# Altium project Robot-Mainboard V3.0.PrjPcb
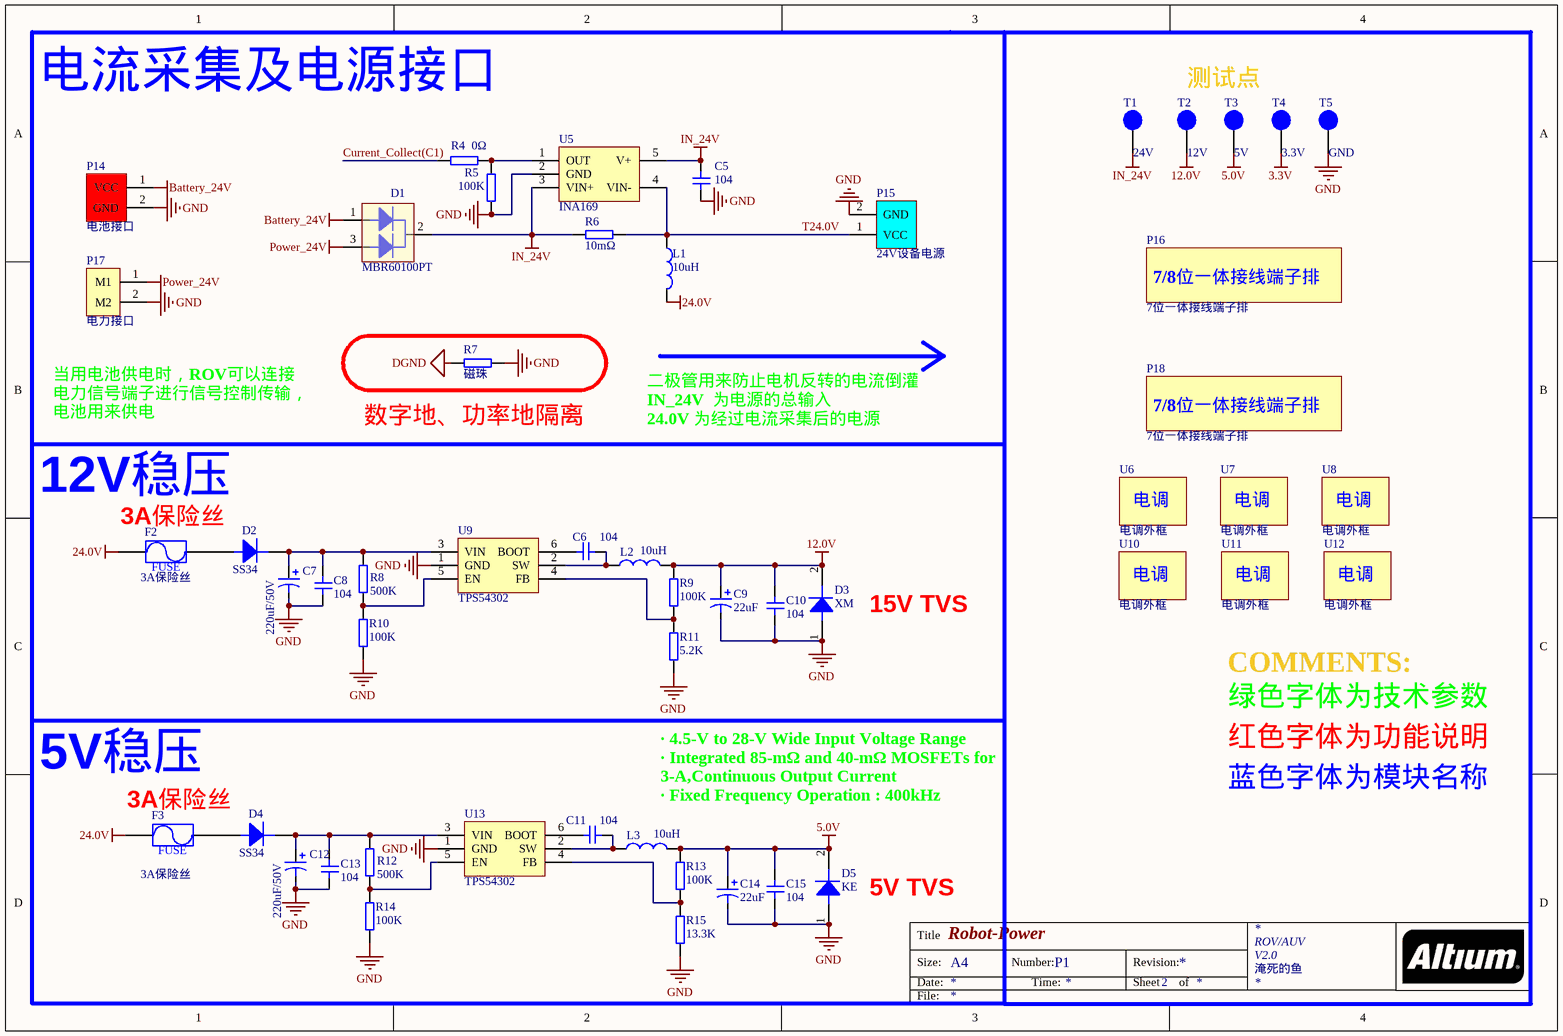
[diagram p0: Robot-Power V3.0.SchDoc]
2 sheets, 79 parts. Net scope: global (net labels, ports and power ports of the same name join across sheets).
Board file: ROV_MainBoard V3.0.PcbDoc
Sheets:
  Robot-Power V3.0.SchDoc
  Robot-Control V3.0.SchDoc

## Sheet Robot-Power V3.0.SchDoc: Robot-Power
size A4; Date: 2019.6.25; Engineer: 淹死的鱼; Address1: ROV/AUV; Address2: V2.0; Address3: 淹死的鱼; DocumentNumber: P1; SheetNumber: 2

### Parts
C5  104  [0805C]
C6  104  [0805C]
C7  220uF/50V  [RB.1.2]
C8  104  [0805C]
C9  22uF  [TAJ-C]
C10  104  [0805C]
C11  104  [0805C]
C12  220uF/50V  [RB.1.2]
C13  104  [0805C]
C14  22uF  [TAJ-C]
C15  104  [0805C]
D1  MBR60100PT  [TO-247LS]
D2  SS34  [SMA/DO-214AC]
D3  XM  [SMBJ]
D4  SS34  [SMA/DO-214AC]
D5  KE  [SMBJ]
F2  3A保险丝  [FUSE-1206]
F3  3A保险丝  [FUSE-1206]
L1  10uH  [CDRH124]
L2  10uH  [CDRH124]
L3  10uH  [CDRH124]
P14  电池接口  [XT60-F]
P15  24V设备电源  [XT60-F]
P16  7位一体接线端子排  [7/8一体接线端子]
P17  电力接口  [XT60-F]
P18  7位一体接线端子排  [7/8一体接线端子]
R4  0Ω  [0805R]
R5  100K  [0805R]
R6  10mΩ  [2512R]
R7  磁珠  [1210R]
R8  500K  [0805R]
R9  100K  [0805R]
R10  100K  [0805R]
R11  5.2K  [0805R]
R12  500K  [0805R]
R13  100K  [0805R]
R14  100K  [0805R]
R15  13.3K  [0805R]
T1  24V  [HEADER 1]
T2  12V  [HEADER 1]
T3  5V  [HEADER 1]
T4  3.3V  [HEADER 1]
T5  GND  [HEADER 1]
U5  INA169  [SOT23-5]
U6  电调外框  [电调外框]
U7  电调外框  [电调外框]
U8  电调外框  [电调外框]
U9  TPS54302  [SOT23-6]
U10  电调外框  [电调外框]
U11  电调外框  [电调外框]
U12  电调外框  [电调外框]
U13  TPS54302  [SOT23-6]

### Nets
3.3V: T4.1
5.0V: C14.1 C15.2 D5.2 L3.2 R13.2 T3.1
12.0V: C9.1 C10.2 D3.2 L2.2 R9.2 T2.1
24.0V: F2.1 F3.1 L1.2
Battery_24V: D1.1 P14.1(VCC)
DGND: R7.2
GND: C5.1 C7.2 C8.1 C9.2 C10.1 C12.2 C13.1 C14.2 C15.1 D3.1 D5.1 P14.2(GND) P15.2(GND) P17.2(M2) R5.2 R7.1 R10.1 R11.1 R14.1 R15.1 T5.1 U5.2(GND) U9.1(GND) U13.1(GND)
IN_24V: C5.2 D1.2 R6.2 T1.1 U5.3(VIN+) U5.5(V+)
Power_24V: D1.3 P17.1(M1)
Current_Collect(C1): R4.1
T24.0V: L1.1 P15.1(VCC) R6.1 U5.4(VIN-)
NetC6_1: C6.1 L2.1 U9.2(SW)
NetC6_2: C6.2 U9.6(BOOT)
NetC7_1: C7.1 C8.2 D2.2 R8.2 U9.3(VIN)
NetC11_1: C11.1 L3.1 U13.2(SW)
NetC11_2: C11.2 U13.6(BOOT)
NetC12_1: C12.1 C13.2 D4.2 R12.2 U13.3(VIN)
NetD2_1: D2.1 F2.2
NetD4_1: D4.1 F3.2
NetR4_2: R4.2 R5.1 U5.1(OUT)
NetR8_1: R8.1 R10.2 U9.5(EN)
NetR9_1: R9.1 R11.2 U9.4(FB)
NetR12_1: R12.1 R14.2 U13.5(EN)
NetR13_1: R13.1 R15.2 U13.4(FB)

### Notes on the sheet
- 电流采集及电源接口
- 测试点
- (near R7) 数字地、功率地隔离
- 二极管用来防止电机反转的电流倒灌
  IN_24V  为电源的总输入
  24.0V 为经过电流采集后的电源
- (near F2) 12V稳压
- 当用电池供电时，ROV可以连接
  电力信号端子进行信号控制传输，
  电池用来供电
- (near F2) 3A保险丝
- (near D3) 15V TVS
- 绿色字体为技术参数
- COMMENTS:
- 5V稳压
- 红色字体为功能说明
- 蓝色字体为模块名称
- (near F3) 3A保险丝
- · 4.5-V to 28-V Wide Input Voltage Range
  · Integrated 85-mΩ and 40-mΩ MOSFETs for 3-A,Continuous Output Current
  · Fixed Frequency Operation : 400kHz
- (near D5) 5V TVS
- Title
- Size:
- Date:
- A4
- Number:
- Time:
- Revision:
- Sheet
- of
- File:
- (in symbol 7位一体接线端子排) 7/8位一体接线端子排
- (in symbol Fuse) FUSE

### Library data of the parts
C5 C6 C8 C10 C11 C13 C15 = Cap1: 无极贴片电容
C7 C12 = Cap3: 直插极性电容
C9 C14 = Pol Cap: 极性贴片电容
D2-D5 = Diode: 二极管
F2 F3 = Fuse: 保险丝
L1-L3 = L: 电感
P14 = 电源端子
P15 = 推进器电源
P17 = 接线端子-2PIN: 2PIN
R4-R15 = Res: 电阻
T1-T5 = 测试点
U6-U8 U10-U12 = 电调

## Sheet Robot-Control V3.0.SchDoc: ROV-Control
size A4; Date: 2019.6.25; ApprovedBy: 10; CompanyName: 9; Engineer: 淹死的鱼; Organization: 5; Address1: ROV/AUV; Address2: V1.0; Address3: 淹死的鱼; Address4: 12; DocumentNumber: P1; Revision: 3; SheetNumber: 2; SheetTotal: 1; Time: 2019.4.6; DocumentFullPathAndName: 8; DocumentName: 7; ModifiedDate: 6; ImagePath: C:\Users\zengwangfa\Pictures\Saved Pictures\电协logo重绘（10000像素版）.png; ProjectName: 4; Application_BuildNumber: 11
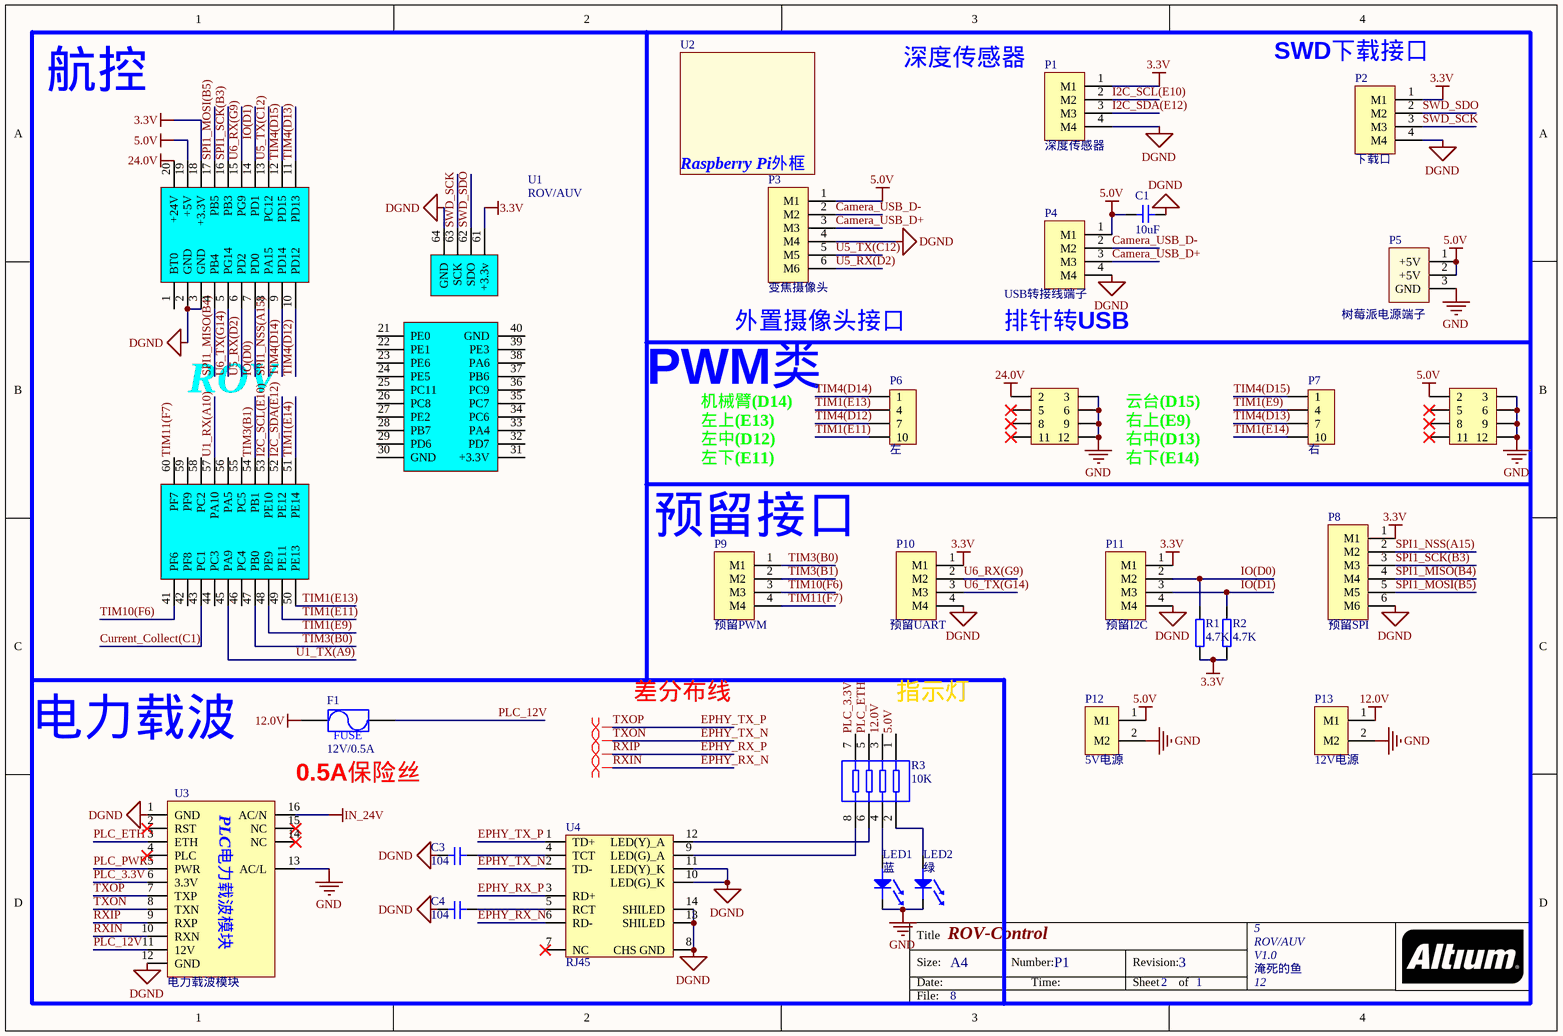
[diagram p1: Robot-Control V3.0.SchDoc]

### Parts
?  (no value)  [JMU_LOGO(1.35cm)]
C1  10uF  [0805C]
C3  104  [0805C]
C4  104  [0805C]
F1  12V/0.5A  [FUSE-1206]
LED1  蓝  [0805LED(RED)]
LED2  绿  [0805LED(RED)]
P1  深度传感器  [MX1.25WS-4P]
P2  下载口  [MX1.25WS-4P]
P3  变焦摄像头  [MX1.25WS-6P]
P4  USB转接线端子  [MX1.25WS-4P]
P5  树莓派电源端子  [XH3/2.54mm/180]
P6  左  [Header 4X3]
P7  右  [Header 4X3]
P8  预留SPI  [MX1.25WS-6P]
P9  预留PWM  [MX1.25WS-4P]
P10  预留UART  [MX1.25WS-4P]
P11  预留I2C  [MX1.25WS-4P]
P12  5V电源  [KF128-2P]
P13  12V电源  [KF128-2P]
R1  4.7K  [0805R]
R2  4.7K  [0805R]
R3  10K  [排阻(4位贴片)]
U1  ROV/AUV  [ROV_CONTROLLER]
U2  (no value)  [Raspberry Pi 外框]
U3  电力载波模块  [电力载波模块6410]
U4  RJ45  [RJ45]

### Nets
3.3V: P1.1(M1) P2.1(M1) P8.1(M1) P10.1(M1) P11.1(M1) R1.1 R2.1 U1.18(+3.3V) U1.61(+3.3v)
5.0V: C1.2 P3.1(M1) P4.1(M1) P5.1(+5V) P5.2(+5V) P7.2 P12.1(M1) R3.1 U1.19(+5V)
12.0V: F1.1 P13.1(M1) R3.3
24.0V: P6.2 U1.20(+24V)
DGND: C1.1 C3.1 C4.1 P1.4(M4) P2.4(M4) P3.4(M4) P4.4(M4) P8.6(M6) P10.4(M4) P11.4(M4) U1.2(GND) U1.3(GND) U1.64(GND) U3.1(GND) U3.12(GND) U4.8(CHS_GND) U4.10(LED(G)_K) U4.11(LED(Y)_K) U4.13(SHILED) U4.14(SHILED)
GND: LED1.2 LED2.2 P5.3(GND) P6.3 P6.6 P6.9 P6.12 P7.3 P7.6 P7.9 P7.12 P12.2(M2) P13.2(M2) U3.13(AC/L)
IN_24V: U3.16(AC/N)
Camera_USB_D+: P3.3(M3) P4.3(M3)
Camera_USB_D-: P3.2(M2) P4.2(M2)
Current_Collect(C1): U1.43(PC1)
EPHY_RX_N: U3.10(RXN) U4.6(RD-)  [also labelled RXIN]
EPHY_RX_P: U3.9(RXP) U4.3(RD+)  [also labelled RXIP]
EPHY_TX_N: U3.8(TXN) U4.2(TD-)  [also labelled TXON]
EPHY_TX_P: U3.7(TXP) U4.1(TD+)  [also labelled TXOP]
I2C_SCL(E10): P1.2(M2) U1.53(PE10)
I2C_SDA(E12): P1.3(M3) U1.52(PE12)
IO(D0): P11.2(M2) R1.2 U1.7(PD0)
IO(D1): P11.3(M3) R2.2 U1.14(PD1)
PLC_3.3V: R3.7 U3.6(3.3V)
PLC_12V: F1.2 U3.11(12V)
PLC_ETH: R3.5 U3.3(ETH)
PLC_PWR: U3.5(PWR)
SPI1_MISO(B4): P8.4(M4) U1.4(PB4)
SPI1_MOSI(B5): P8.5(M5) U1.17(PB5)
SPI1_NSS(A15): P8.2(M2) U1.8(PA15)
SPI1_SCK(B3): P8.3(M3) U1.16(PB3)
SWD_SCK: P2.3(M3) U1.63(SCK)
SWD_SDO: P2.2(M2) U1.62(SDO)
TIM1(E9): P7.4 U1.48(PE9)
TIM1(E11): P6.10 U1.49(PE11)
TIM1(E13): P6.4 U1.50(PE13)
TIM1(E14): P7.10 U1.51(PE14)
TIM3(B0): P9.1(M1) U1.47(PB0)
TIM3(B1): P9.2(M2) U1.54(PB1)
TIM4(D12): P6.7 U1.10(PD12)
TIM4(D13): P7.7 U1.11(PD13)
TIM4(D14): P6.1 U1.9(PD14)
TIM4(D15): P7.1 U1.12(PD15)
TIM10(F6): P9.3(M3) U1.41(PF6)
TIM11(F7): P9.4(M4) U1.60(PF7)
U1_RX(A10): U1.57(PA10)
U1_TX(A9): U1.45(PA9)
U5_RX(D2): P3.6(M6) U1.6(PD2)
U5_TX(C12): P3.5(M5) U1.13(PC12)
U6_RX(G9): P10.2(M2) U1.15(PG9)
U6_TX(G14): P10.3(M3) U1.5(PG14)
NetC3_2: C3.2 U4.4(TCT)
NetC4_2: C4.2 U4.5(RCT)
NetLED1_1: LED1.1 R3.4
NetLED2_1: LED2.1 R3.2
NetR3_6: R3.6 U4.12(LED(Y)_A)
NetR3_8: R3.8 U4.9(LED(G)_A)

Not connected (* = marked no-connect by the designer): P6 5* 8* 11*; P7 5* 8* 11*; U1 1(BT0) 21(PE0) 22(PE1) 23(PE6) 24(PE5) 25(PC11) 26(PC8) 27(PE2) 28(PB7) 29(PD6) 30(GND) 31(+3.3V) 32(PD7) 33(PA4) 34(PC6) 35(PC7) 36(PC9) 37(PB6) 38(PA6) 39(PE3) 40(GND) 42(PF8) 44(PC3) 46(PC4) 55(PC5) 56(PA5) 58(PC2) 59(PF9); U3 2(RST)* 4(PLC)* 14(NC)* 15(NC)*; U4 7(NC)*

### Layout directives
differential pair: EPHY_RX_N, EPHY_RX_P, EPHY_TX_N, EPHY_TX_P

### Notes on the sheet
- 航控
- 深度传感器
- (near P2) SWD下载接口
- (near P3) 外置摄像头接口
- (near P4) 排针转USB
- PWM类
- 机械臂(D14)
  左上(E13)
  左中(D12)
  左下(E11)
- 云台(D15)
  右上(E9)
  右中(D13)
  右下(E14)
- (near P9) 预留接口
- 差分布线
- 指示灯
- 电力载波
- 0.5A保险丝
- Title
- Size:
- Date:
- A4
- Number:
- Time:
- Revision:
- Sheet
- of
- File:
- (in symbol Fuse) FUSE
- (in symbol Raspberry Pi 外框) Raspberry Pi外框
- (in symbol ROV_Controler) ROV
- (in symbol 电力载波模块6410) PLC电力载波模块

### Library data of the parts
? = JMU_LOGO: LOGO
C1 C3 C4 = Cap1: 无极贴片电容
F1 = Fuse: 保险丝
LED1 LED2 = LED: 发光二极管
P1 P2 P4 P9-P11 = 接线端子-4PIN: 4PIN
P3 P8 = 接线端子-6PIN: 6PIN
P5 = 接线端子-3PIN: 3PIN
P6 P7 = Header 4X3
P12 P13 = 接线端子-2PIN: 2PIN
R1 R2 = Res: 电阻
R3 = Res-4: 排阻
U1 = ROV_Controler
U2 = Raspberry Pi 外框
U3 = 电力载波模块6410

## Nets that join several sheets
3.3V: Robot-Power V3.0 (T4.1), Robot-Control V3.0 (9 pins)
5.0V: Robot-Power V3.0 (6 pins), Robot-Control V3.0 (9 pins)
12.0V: Robot-Power V3.0 (6 pins), Robot-Control V3.0 (F1.1 P13.1 R3.3)
24.0V: Robot-Power V3.0 (F2.1 F3.1 L1.2), Robot-Control V3.0 (P6.2 U1.20)
DGND: Robot-Power V3.0 (R7.2), Robot-Control V3.0 (20 pins)
GND: Robot-Power V3.0 (24 pins), Robot-Control V3.0 (14 pins)
IN_24V: Robot-Power V3.0 (6 pins), Robot-Control V3.0 (U3.16)
Current_Collect(C1): Robot-Power V3.0 (R4.1), Robot-Control V3.0 (U1.43)